# EAGLE schematic SWITCH (EAGLE 7.2.0)
CNAME: Switch configurations; CREVISION: 1.0; DESIGNER: S.j.de.Bakker@hr.nl
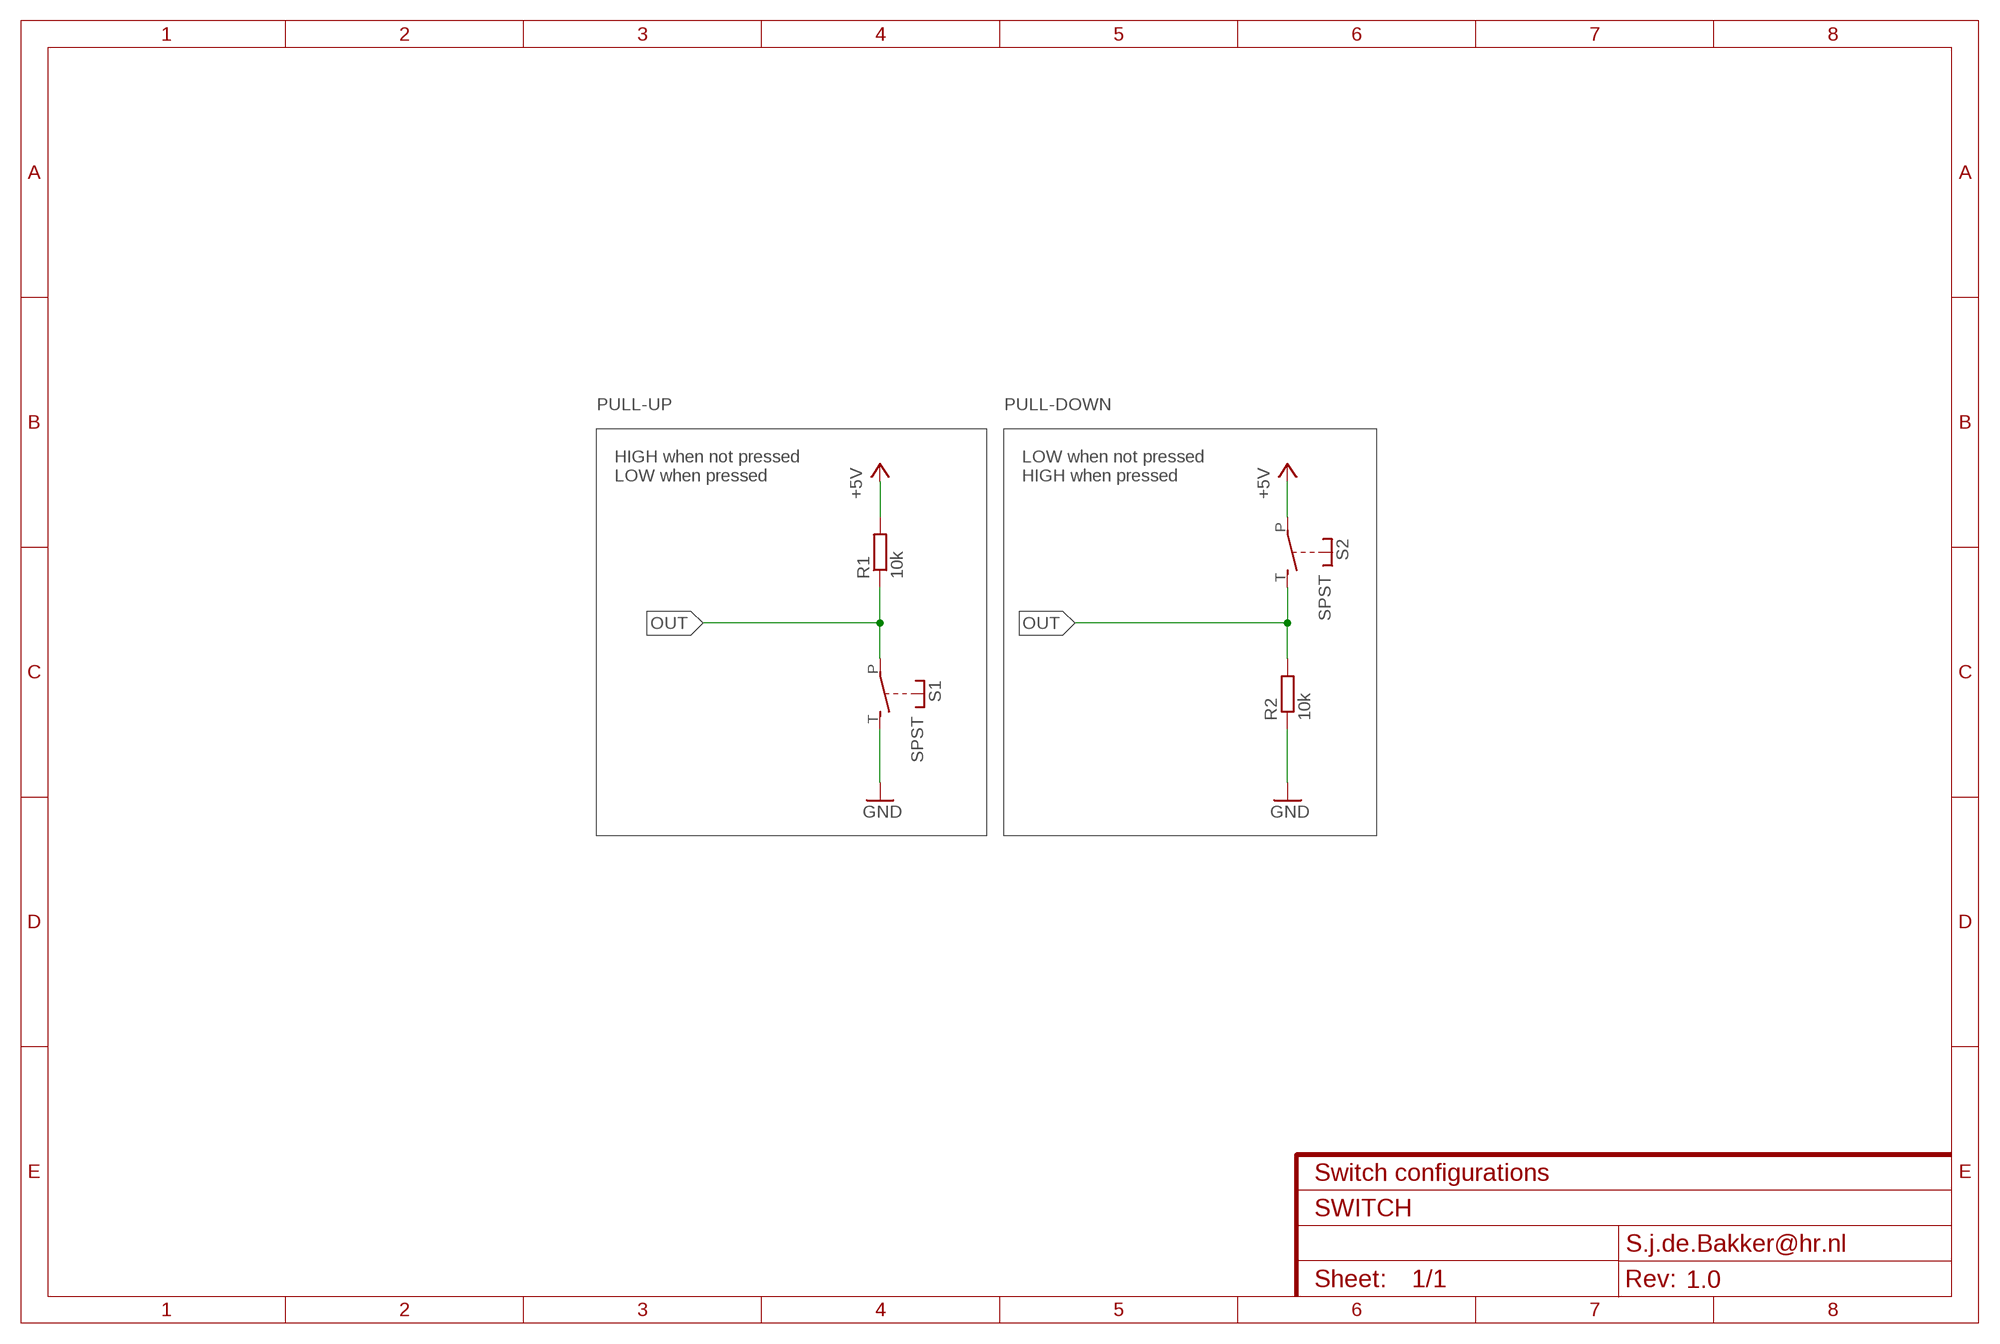
[diagram p0: schematic, sheet 1]

## Parts
R1  10k  R-EU_R0603  [R0603]
R2  10k  R-EU_R0603  [R0603]
S1  SPST  [JUDCOSPST]
S2  SPST  [JUDCOSPST]

## Nets
+5V: R1.2 S2.P
GND: R2.1 S1.T(S)
OUT: R1.1 R2.2 S1.P S2.T(S)

## Notes on the sheet
- PULL-UP | PULL-DOWN
- HIGH when not pressed
  LOW when pressed
- LOW when not pressed
  HIGH when pressed

## Library data of the parts
R1 R2 = rcl:R-EU_: RESISTOR, European symbol
S1 S2 = adafruit:SPST: Judco 50-0015-00